# Altium schematic sheet Battery_Circuit.SchDoc
size A; SheetNumber: 3; SheetTotal: 4
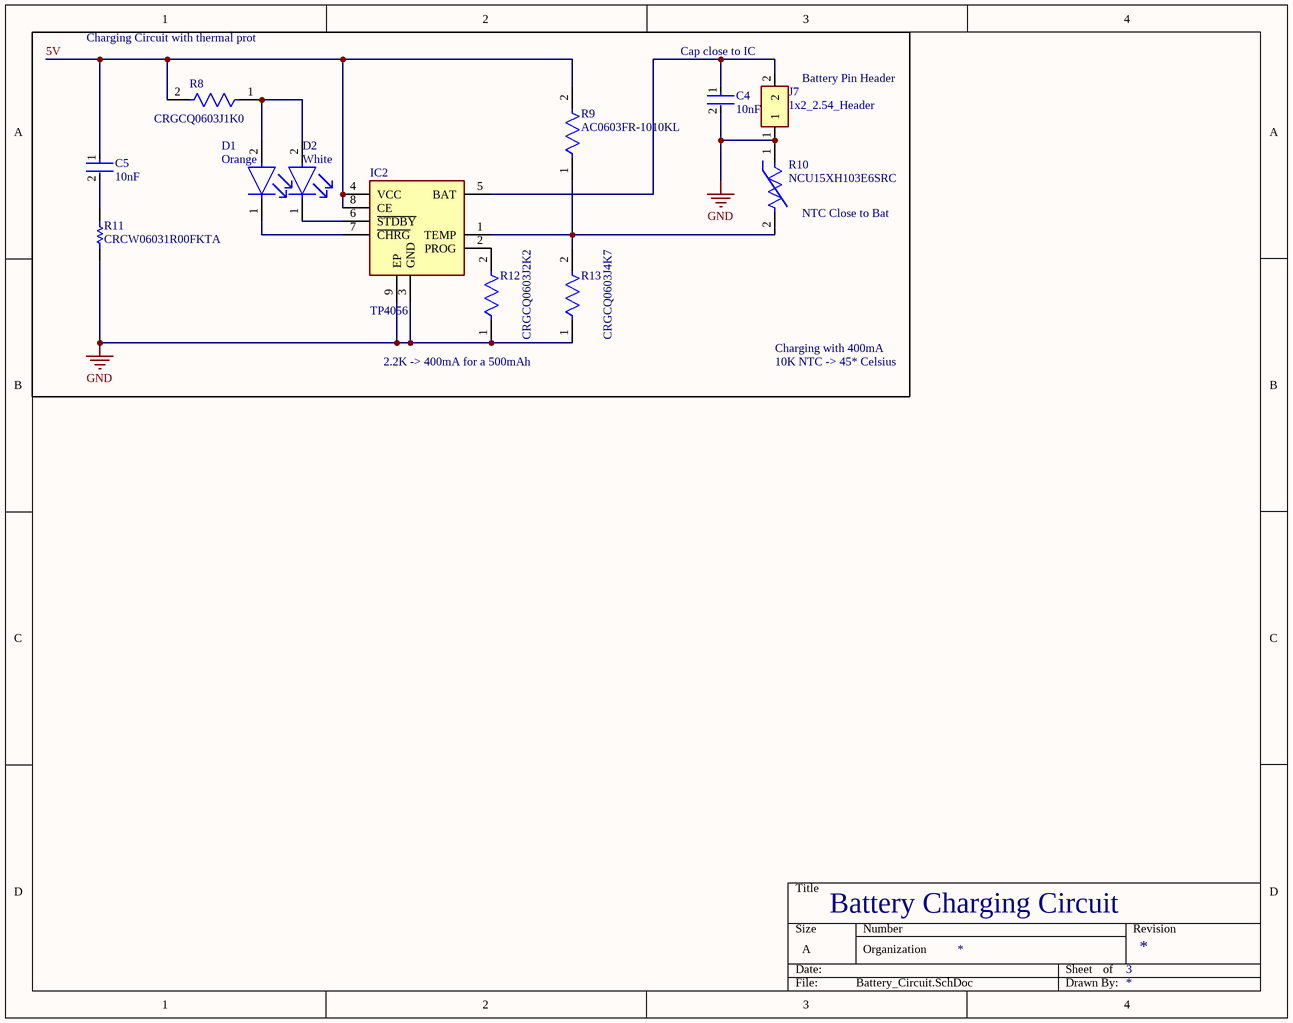
[diagram p0: Battery_Circuit.SchDoc]

## Parts
C4  10nF  [FP-CL10-IPC_C]
C5  10nF  [FP-CL10-IPC_C]
D1  Orange  [FP-LTST-C190KFKT-MFG]
D2  White  [FP-6_541-5091_01-4-MFG]
IC2  TP4056  [SOIC127P600X175-9N]
J7  1x2_2.54_Header  [1x2_2.54_Header]
R8  CRGCQ0603J1K0  [FP-CRGCQ0603-IPC_C]
R9  AC0603FR-1010KL  [FP-AC0603-IPC_B]
R10  NCU15XH103E6SRC  [FP-NCP15-NCU15-0_05-IPC_A]
R11  CRCW06031R00FKTA  [RESC1609X50X30NL10T20]
R12  CRGCQ0603J2K2  [FP-CRGCQ0603-IPC_C]
R13  CRGCQ0603J4K7  [FP-CRGCQ0603-IPC_C]

## Nets
GND: C4.2 IC2.3(GND) IC2.9(EP) J7.1 R10.1 R11.1 R12.1 R13.1
5V: C5.1 IC2.4(VCC) IC2.8(CE) R8.2 R9.2
NetC4_1: C4.1 IC2.5(BAT) J7.2
NetC5_2: C5.2 R11.2
NetD1_1: D1.1(C) IC2.7(~{CHRG})
NetD1_2: D1.2(A) D2.2(A) R8.1
NetD2_1: D2.1(C) IC2.6(~{STDBY})
NetIC2_1: IC2.1(TEMP) R9.1 R10.2 R13.2
NetIC2_2: IC2.2(PROG) R12.2

## Notes on the sheet
- Charging Circuit with thermal prot
- Cap close to IC
- (near J7) Battery Pin Header
- (near R10) NTC Close to Bat
- 2.2K -> 400mA for a 500mAh
- Charging with 400mA
- 10K NTC -> 45* Celsius
- Battery Charging Circuit
- Organization

## Library data of the parts
C4 C5 = CMP-13271-004285-1: Cap Ceramic 10nF 25V X7R ±10% Pad SMD 0603 +125°C T/R; Voltage: 50V; Height: 0.8mm; Tolerance: 10%; Package Quantity: 4000; Width: 0.031inch; Case/Package: 0603; Thickness: 0.035inch; Capacitance: 10nF; Packaging: Tape and Reel; Min Operating Temperature: -55°C; RoHS Compliant: Yes; Voltage Rating: 25V; Case Code (Imperial): 0603; Radiation Hardening: No; Depth: 0.8mm; Series: CL; Contact Plating: Tin; Mount: Surface Mount; Construction: Flat; Case Code (Metric): 1608; Length: 1.6mm; Max Operating Temperature: 125°C; Dielectric: X7R
D1 = CMP-1674-00008-9: LED ORANGE CLEAR CHIP SMD; Luminous Intensity: 90mcd; Viewing Angle: 130°; Wavelength: 611nm; Lens Color: Colorless; Test Current: 20mA; Lens Style: Flat; Reverse Voltage: 5V; Power Dissipation: 75mW; Number of Elements: 1; Forward Current: 30mA; Lens Size: 0.8mm; Dominant Wavelength: 605nm; Forward Voltage: 2V; Min Operating Temperature: -55°C; Lens Transparency: Clear; RoHS Compliant: Yes; Case Code (Metric): 1608; Color: Orange; Width: 0.8mm; Number of Pins: 2; Depth: 1.6mm; Case/Package: 0603; Radiation Hardening: No; Case Code (Imperial): 0603; Max Operating Temperature: 85°C; Number of LEDs: 1; Height: 0.9mm; Mount: Surface Mount; Packaging: Tape and Reel; Length: 3.2mm; Package Quantity: 3000; Power Rating: 75mW; Lead Free: Lead Free; Illumination Color: Orange; Series: -
D2 = CMP-02520-000007-1: LED COOL WHITE 0603 SMD; Manufacturer: Vishay; Manufacturer Part Number: VLMW1300-GS08; Viewing Angle: 130°; Forward Voltage: 3.15V; Luminous Intensity: 180mcd; Forward Current: 5mA; Led Orientation: Top View; Power Dissipation: 70mW; Category: Diode; Device Class L2: LEDs; Device Class L1: Optoelectronics; ComponentLink2URL: http://www.vishay.com/docs/82435/vlmw1300.pdf; Octopart: https://octopart.com/vlmw1300-gs08-vishay-21709203; Mouser Description: LED; SMD; 0603; white cold; 45-180mcd; 7000(typ)K; 130°; 5mA; Automotive: No; Ambient Temperature Range High: +80°C; Colour: White; Device Class L3: unset; Temperature Range High: +80°C; Height: 0.75mm; Package: 6.541-5091.01-4; RoHS: TRUE; Digikey Description: LED COOL WHITE 0603 SMD; Lead Free: Yes; Ambient Temperature Range Low: -20°C; ComponentLink2Description: Datasheet; Temperature Range Low: -20°C; Temperature: -20°C to +80°C
IC2 = TP4056: Integrated Circuit; Manufacturer_Name: TPOWER; Datasheet Link: https://pdf1.alldatasheet.com/datasheet-pdf/download/1133270/TPOWER/TP4056.html; Height: 1.75mm; Manufacturer_Part_Number: TP4056
J7 = 1x2_2.54_Header: Connector
R8 = CMP-03211-006828-1: CRGCQ 0603 1K0 5%; Manufacturer: TE Connectivity; Resistance: 1KΩ; Temperature Coefficient: ±100ppm/°C; Value: 1KΩ; Tolerance: 0.05; Power Rating: 0.1W; Voltage Rating: 75V; Temperature: -55°C to +155°C; Height: 0.55mm; Lead Free: Yes; Device Class L1: Passive Components; Manufacturer Part Number: CRGCQ0603J1K0; Device Class L3: Chip SMD Resistors; Series: CRGCQ; Octopart: https://octopart.com/crgcq0603j1k0-te+connectivity-91018104; Category: Res; RoHS: TRUE; Temperature Range High: +155°C; Digikey Description: CRGCQ 0603 1K0 5%; Ambient Temperature Range High: +70°C; ComponentLink2Description: Datasheet; Device Class L2: Resistors; Package: CRGCQ0603; Ipc Land Pattern Name: RESC16080X45; Temperature Range Low: -55°C; ComponentLink2URL: https://www.te.com/commerce/DocumentDelivery/DDEController?Action=showdoc&DocId=Data+Sheet%7F1773204-3%7F1%7Fpdf%7FEnglish%7FENG_DS_1773204-3_1.pdf%7F4-2176339-695; Composition: Thick Film
R9 = CMP-03412-017743-2: RES 10KΩ 1.00% 0.1W 0603; Tolerance: 1%; Resistance: 10kR; Voltage Rating: 50V; Temperature Coefficient: 100ppm/°C; Power Rating: 100mW; RoHS Compliant: Yes; Max Operating Temperature: 155°C; Min Operating Temperature: -55°C; Width: 0.8mm; Packaging: Tape and Reel; Height: 0.45mm; Termination: SMD/SMT; Length: 1.6mm; Weight: 7.1E-05oz; Case Code (Imperial): 0603; Case Code (Metric): 1608; Series: AC; Case/Package: 0603
R10 = CMP-06022-000214-2: NTC Thermistor for Temperature Sensor, Automotive, 0402, 10kΩ, 3%, 0.1mA, 5V; RoHS Compliant: Yes
R11 = CMP-2000-03048-1: 1OHM; Manufacturer: Vishay Dale; Part Number: CRCW06031R00FKTA
R12 = CMP-03211-007977-1: CRGCQ0603 2.2KΩ 5% ±100ppm/°C 75V; Manufacturer: TE Connectivity; Power Rating: 0.1W; Tolerance: 0.05; RoHS: TRUE; Manufacturer Part Number: CRGCQ0603J2K2; Device Class L1: Passive Components; Package: CRGCQ0603; Resistance: 2.2KΩ; Category: Res; Value: 2.2KΩ; Temperature Range Low: -55°C; Device Class L3: Chip SMD Resistors; Temperature Coefficient: ±100ppm/°C; Ambient Temperature Range High: +70°C; Temperature Range High: +155°C; Composition: Thick Film; Height: 0.55mm; ComponentLink2URL: https://www.te.com/commerce/DocumentDelivery/DDEController?Action=showdoc&DocId=Data+Sheet%7F1773204-3%7F1%7Fpdf%7FEnglish%7FENG_DS_1773204-3_1.pdf%7F4-2176339-767; Device Class L2: Resistors; Voltage Rating: 75V; Octopart: https://octopart.com/crgcq0603j2k2-te+connectivity-91018114; ComponentLink2Description: Datasheet; Series: CRGCQ; Lead Free: Yes; Ipc Land Pattern Name: RESC16080X45; Temperature: -55°C to +155°C
R13 = CMP-03211-000648-1: CRGCQ 0603 4K7 5%; Manufacturer: TE Connectivity; Tolerance: 0.05; Temperature Coefficient: ±100ppm/°C; Voltage Rating: 75V; Power Rating: 0.1W; Value: 4.7KΩ; ComponentLink2URL: https://www.te.com/commerce/DocumentDelivery/DDEController?Action=showdoc&DocId=Data+Sheet%7F1773204-3%7F1%7Fpdf%7FEnglish%7FENG_DS_1773204-3_1.pdf%7F4-2176339-847; Device Class L3: Chip SMD Resistors; Ipc Land Pattern Name: RESC16080X45; Digikey Description: CRGCQ 0603 4K7 5%; Temperature Range Low: -55°C; Octopart: https://octopart.com/crgcq0603j4k7-te+connectivity-91018128; RoHS: TRUE; Lead Free: Yes; Mouser Description: Res Thick Film 0603 4.7K Ohm 5% 0.1W(1/10W) ±100ppm/C Pad SMD Automotive T/R; Category: Res; ComponentLink2Description: Datasheet; Temperature: -55°C to +155°C; Device Class L2: Resistors; Temperature Range High: +155°C; Ambient Temperature Range High: +70°C; Composition: Thick Film; Height: 0.55mm; Series: CRGCQ; Package: CRGCQ0603; Manufacturer Part Number: CRGCQ0603J4K7; Resistance: 4.7KΩ; Device Class L1: Passive Components